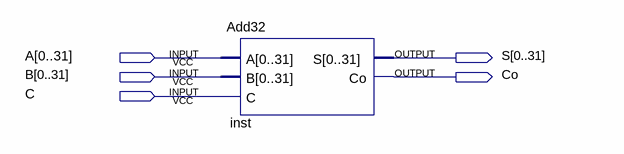
[diagram p0: schematic sheet]
// Quartus schematic Adder.bdf as structural Verilog: 1 symbols, 5 pins
module Adder (
  input  [0:31] A,
  input  [0:31] B,
  input  C,
  output [0:31] S,
  output Co
);

  Add32 inst (.A(A), .B(B), .C(C), .S(S), .Co(Co));
endmodule
